# Altium schematic sheet ldo_3v3.SchDoc
size A; SheetNumber: 4; SheetTotal: 4
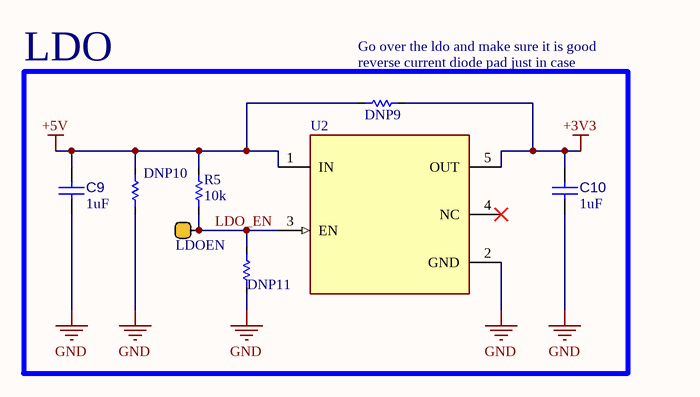
[diagram p0: ldo_3v3.SchDoc]

## Parts
C9  value 1uF  [CAP_0603]  (hidden comment: CAP CER 220nF 50V 10% 0603)
C10  value 1uF  [CAP_0603]  (hidden comment: CAP CER 220nF 50V 10% 0603)
DNP9  DNP - DNP PAD 0603  [DNP 0603]  (value not drawn)
DNP10  DNP - DNP PAD 0603  [DNP 0603]  (value not drawn)
DNP11  DNP - DNP PAD 0603  [DNP 0603]  (value not drawn)
LDOEN  TP - SMD Pad Testpoint-Symbol-1  [TP - SMD Pad Testpoint]  (value not drawn)
R5  value 10k  [RES 0603]  (hidden comment: R - RES 10kR 0.1W 1% 0603)
U2  TLV75733PDBVR  [U - TLV75733PDBVR]  (value not drawn)

## Nets
+3V3: C10.2 DNP9.2 U2.5(OUT)
+5V: C9.2 DNP9.1 DNP10.2 R5.2 U2.1(IN)
GND: C9.1 C10.1 DNP10.1 DNP11.1 U2.2(GND)
LDO_EN: DNP11.2 LDOEN.1 R5.1 U2.3(EN)

Not connected (* = marked no-connect by the designer): U2 4(NC)*

## Notes on the sheet
- (near DNP9) Go over the ldo and make sure it is good
- LDO
- (near DNP9) reverse current diode pad just in case

## Library data of the parts
C9 C10 = C - CAP CER 1uF 25V 10% 0603: GCJ188R71E105KA01D - 1 µF ±10% 25V Ceramic Capacitor X7R 0603 (1608 Metric); Parameter 2: *
LDOEN = TP - SMD Pad Testpoint-Symbol-1: Testpoint used for debugging and testing. SMD Pad
R5 = R - RES 10kR 0.1W 1% 0603: ERA-3AEB103V - 10 kOhms ±0.1% 0.1W, 1/10W Chip Resistor 0603 (1608 Metric) Automotive AEC-Q200 Thin Film
U2 = U - TLV75733PDBVR: TLV75733PDBVR - 1-A, low-IQ high-accuracy low-dropout (LDO) voltage regulator with enable 5-SOT-23 -40 to 125; Manufacturer_Name: Texas Instruments; TYPE: TYPE; RefDes: RefDes; Copyright: Copyright (C) 2025 Ultra Librarian. All rights reserved.; Manufacturer_Part_Number: TLV75733PDBVR